# Altium schematic sheet Power_Supply.SchDoc
size 254 x 203 mm; Author: Aurimas Vilkas; DrawnBy: Aurimas Vilkas; Engineer: Aurimas Vilkas
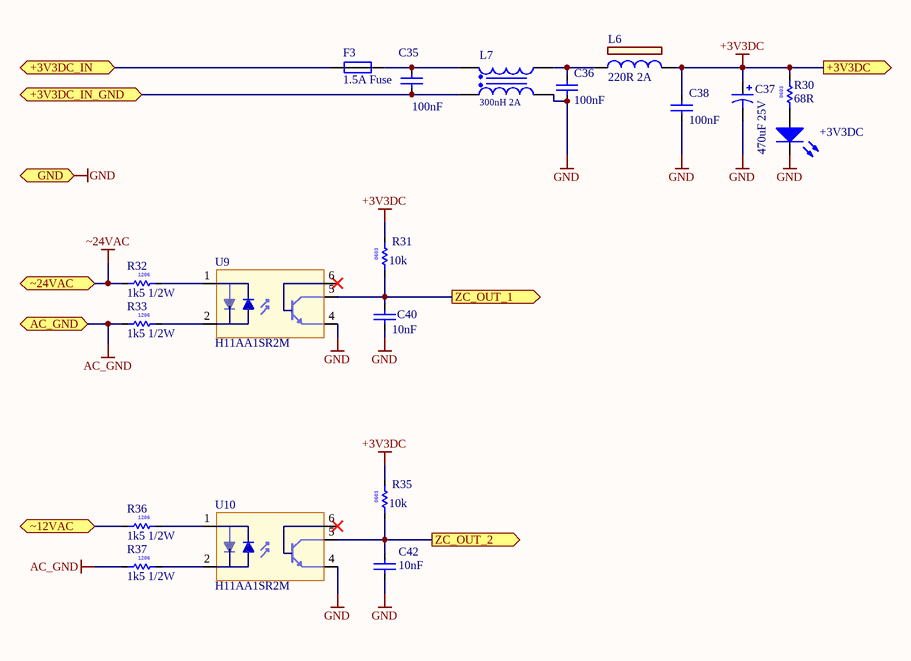
[diagram p0: Power_Supply.SchDoc]

## Parts
+3V3DC  Green LED  [LED_GRN]  (value not drawn)
C35  100nF  [CAPC1608N]
C36  100nF  [CAPC1608N]
C37  470uF 25V  [10X10.5]
C38  100nF  [CAPC1608N]
C40  10nF  [CAPC1608N]
C42  10nF  [CAPC1608N]
F3  1.5A Fuse  [1206F]
L6  220R 2A  [LL0805\2P]
L7  300nH 2A  [1812_CM_WE]
R30  68R  [RESC1608N]
R31  10k  [RESC1608N]
R32  1k5 1/2W  [RESC3216N]
R33  1k5 1/2W  [RESC3216N]
R35  10k  [RESC1608N]
R36  1k5 1/2W  [RESC3216N]
R37  1k5 1/2W  [RESC3216N]
U9  H11AA1SR2M  [SMDIP-6]
U10  H11AA1SR2M  [SMDIP-6]

## Ports
+3V3DC (out), +3V3DC_IN (bidir), +3V3DC_IN_GND (bidir), AC_GND (bidir), GND (bidir), ZC_OUT_1 (out), ZC_OUT_2 (out), ~12VAC (bidir), ~24VAC (bidir)

## Nets
+3V3DC: C37.1 C38.2 L6.2 R30.2 R31.2 R35.2 ; port +3V3DC
AC_GND: R33.1 R37.1 ; port AC_GND
GND: +3V3DC.2(K) C36.1 C37.2 C38.1 C40.2 C42.2 L7.2 U9.4(E) U10.4(E) ; port GND
~24VAC: R32.1 ; port ~24VAC
+3V3DC_IN: F3.1 ; port +3V3DC_IN
+3V3DC_IN_GND: C35.1 L7.1 ; port +3V3DC_IN_GND
ZC_OUT_1: C40.1 R31.1 U9.5(C) ; port ZC_OUT_1
ZC_OUT_2: C42.1 R35.1 U10.5(C) ; port ZC_OUT_2
~12VAC: R36.1 ; port ~12VAC
Net+3V3DC_1: +3V3DC.1(A) R30.1
NetC35_2: C35.2 F3.2 L7.4
NetC36_2: C36.2 L6.1 L7.3
NetR32_2: R32.2 U9.1(A)
NetR33_2: R33.2 U9.2(K)
NetR36_2: R36.2 U10.1(A)
NetR37_2: R37.2 U10.2(K)

Not connected (* = marked no-connect by the designer): U9 6(B)*; U10 6(B)*

## Notes on the sheet
- Title
- Size:
- Date:
- Custom
- Drawn By:
- Time:
- Revision:
- Sheet
- of
- Kaunas
- Lithuania
- Author:
- Engineer:
- Project Name:
- (in symbol R0000002) 0603
- (in symbol R0000008) 0603
- (in symbol R2412076) 1206

## Library data of the parts
+3V3DC = KPT-2012SGC: KPT-2012SGC -  LED, Low Power, Green, SMD, 2mm x 1.25mm, 20 mA, 2.2 V, 568 nm; Supplier 1: Farnell; Supplier Part Number 1: 2099239
C35 C36 C38 = C0000005: MC0805B104K250CT -  SMD Multilayer Ceramic Capacitor, 0.1 µF, 25 V, 0805 [2012 Metric], ± 10%, X7R, MC Series; Supplier 1: Farnell; Supplier Part Number 1: 1759166
C37 = 470uF 25V: MCVVT025M471GB3L -  SMD Aluminium Electrolytic Capacitor, Radial Can - SMD, 470 µF, 25 V, VT, V-Chip Series; Supplier 1: Farnell; Supplier Part Number 1: 2611378
C40 C42 = C0000009: MCU0603R103KCT -  SMD Multilayer Ceramic Capacitor, 10000 pF, 50 V, 0603 [1608 Metric], ± 10%, X7R, MCU Series; Supplier 1: Farnell; Supplier Part Number 1: 9406182
F3 = 1.5A Fuse: MCCFB1206TFF/1.5 -  Fuse, Surface Mount, 1.5 A, 32 V, Fast Acting, 1206; Supplier 1: Farnell; Supplier Part Number 1: 1652166
L6 = L0000004: BLM21PG221SN1D -  Ferrite Bead, 0805 [2012 Metric], 220 ohm, 2 A, BLM21P Series, 0.045 ohm, ± 25%; Supplier 1: Farnell; Supplier Part Number 1: 1515661
L7 = 300 nH: 744235900 -  Filter, Line, Common Mode, 300 nH, WE-CNSW Series, 90 ohm, 2 A, 4.5mm x 3.2mm x 2.8mm; Supplier 1: Farnell; Supplier Part Number 1: 2249865
R30 = R0000002: MCSR06X68R0FTL -  SMD Chip Resistor, 68 ohm, MCSR 06 Series, 75 V, Ceramic, 0603 [1608 Metric], 100 mW; Supplier 1: Farnell; Supplier Part Number 1: 2074301
R31 R35 = R0000008: MCWR06X1002FTL -  SMD Chip Resistor, 0603 [1608 Metric], 10 kohm, MCWR Series, 50 V, Thick Film, 100 mW; Supplier 1: Farnell; Supplier Part Number 1: 2447230
R32 R33 R36 R37 = R2412076: MCWF12P1501FTL -  SMD Chip Resistor, 1206 [3216 Metric], 1.5 kohm, MCWF12P Series, 200 V, Thick Film, 500 mW; Supplier 1: Farnell; Supplier Part Number 1: 2694448
U9 U10 = H11AA1SR2M: H11AA1SR2M -  Optocoupler, Transistor Output, 1 Channel, Surface Mount DIP, 6 Pins, 60 mA, 7.5 kV, 20 %; Supplier 1: Farnell; Supplier Part Number 1: 2322525